# Altium schematic sheet sheet3_pd_controller.SchDoc
size A; SheetNumber: 3; SheetTotal: 3
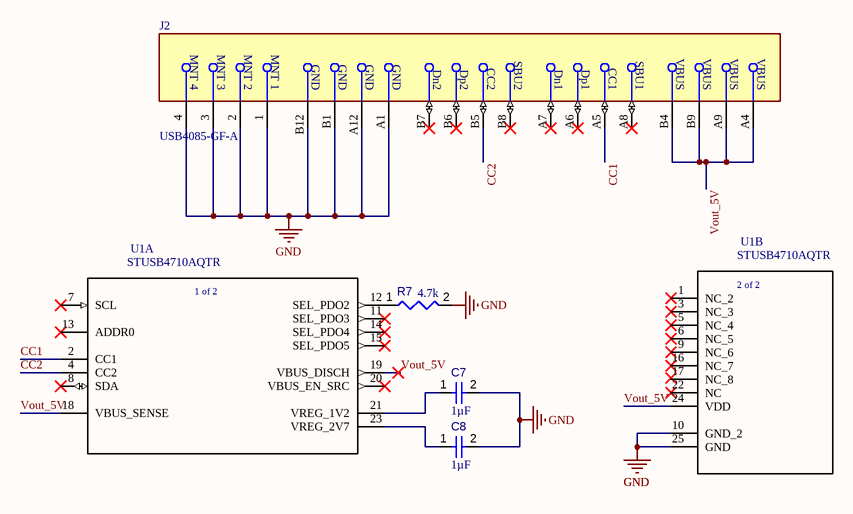
[diagram p0: sheet3_pd_controller.SchDoc]

## Parts
C7  value 1µF  [CAPC2013X135X45NL10T25]  (hidden comment: Capacitor 1 uF +/- 10% 50 V 0805)
C8  value 1µF  [CAPC2013X135X45NL10T25]  (hidden comment: Capacitor 1 uF +/- 10% 50 V 0805)
J2  USB4085-GF-A  [FP-USB4085-GF-A-MFG]
R7  value 4.7k  [RESC2013X70X40ML20T20]  (hidden comment: Resistor 4k7 +/-1% 0805 125 mW)
U1  STUSB4710AQTR  [*QFN24EP_4X4_STM]  (parts A,B of 2)

## Nets
GND: C7.2 C8.2 J2.1(MNT_1) J2.2(MNT_2) J2.3(MNT_3) J2.4(MNT_4) J2.A1(GND) J2.A12(GND) J2.B1(GND) J2.B12(GND) R7.2 U1.10(GND_2) U1.25(GND)
CC1: J2.A5(CC1) U1.2(CC1)
CC2: J2.B5(CC2) U1.4(CC2)
Vout_5V: J2.A4(VBUS) J2.A9(VBUS) J2.B4(VBUS) J2.B9(VBUS) U1.18(VBUS_SENSE) U1.19(VBUS_DISCH) U1.24(VDD)
NetC7_1: C7.1 U1.21(VREG_1V2)
NetC8_1: C8.1 U1.23(VREG_2V7)
NetR7_1: R7.1 U1.12(SEL_PDO2)

Not connected (* = marked no-connect by the designer): J2 A6(Dp1)* A7(Dn1)* A8(SBU1)* B6(Dp2)* B7(Dn2)* B8(SBU2)*; U1 1(NC_2)* 3(NC_3)* 5(NC_4)* 6(NC_5)* 7(SCL)* 8(SDA)* 9(NC_6)* 11(SEL_PDO3)* 13(ADDR0)* 14(SEL_PDO4)* 15(SEL_PDO5)* 16(NC_7)* 17(NC_8) 20(VBUS_EN_SRC)* 22(NC)*

## Notes on the sheet
- (in symbol CMP-036-000000-1, part A) 1 of 2
- (in symbol CMP-036-000000-1, part B) 2 of 2

## Library data of the parts
C7 C8 = CMP-001-00007-6: Chip Capacitor, 1 uF, +/- 10%, 50 V, 0805 (2012 Metric); Capacitor Type: Ceramic; Voltage Rating: 50V; Min Operating Temperature: -55°C; RoHS Compliant: True; Mounting Technology: SM; Case/Package: 0805; Max Operating Temperature: 125°C; Tolerance: 10%; Pins: 2
J2 = CMP-196119-000001-2: CONN RCPT USB2.0 TYPE C 24POS RA; Gender: Receptacle; Number of Positions: 16; USB Standard: USB 2.0; Orientation: Right Angle; Contact Plating: Gold; Contact Material: Copper Alloy
R7 = CMP-009-00032-5: Chip Resistor, 4.7 KOhm, +/- 1%, 0.125 W, -55 to 155 degC, 0805 (2012 Metric); Power: 125mW; Voltage Rating: 150V; Max Operating Temperature: 155°C; Min Operating Temperature: -55°C; Case/Package: 0805; RoHS Compliant: True; Pins: 2; Tolerance: 1%; Mounting Technology: SM
U1 = CMP-036-000000-1: USB Controller USB 2.0 I2C Interface 24-QFN (4x4); MF: STMicroelectronics; Value: *; Source: STUSB4710AQTR.SchLib; Design Item ID: STUSB4710AQTR; SnapEDA_Link: https://www.snapeda.com/parts/STUSB4710AQTR/STMicroelectronics/view-part/?ref=snap; MP: STUSB4710AQTR; Package: QFN-24 STMicroelectronics; Check_prices: https://www.snapeda.com/parts/STUSB4710AQTR/STMicroelectronics/view-part/?ref=eda